# EAGLE design atmega328_isp (EAGLE 6.5.0)
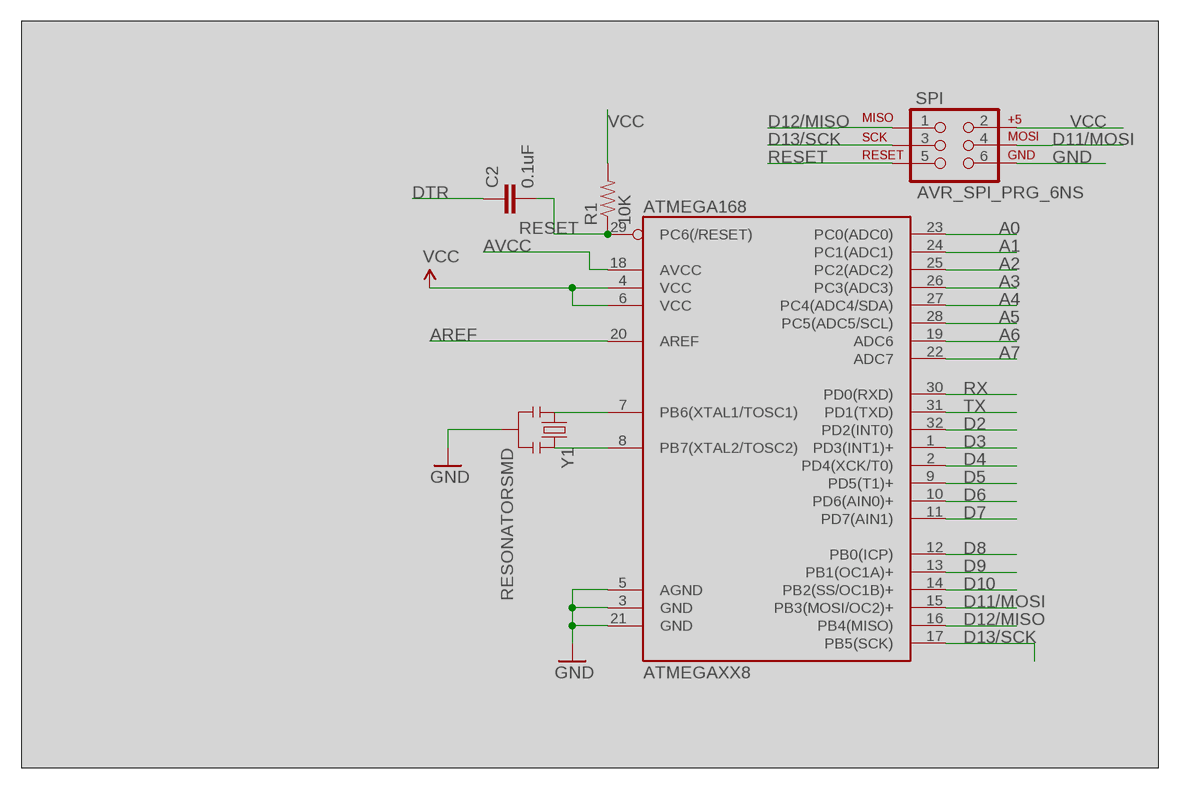
[diagram p0: schematic, sheet 1]

## Parts
ATMEGAXX8  ATMEGA168  [TQFP32-08]
C2  0.1uF  CAP0805  [0805]
R1  10K  RESISTOR0805-RES  [0805]
SPI  AVR_SPI_PRG_6NS  [2X3-NS]
Y1  RESONATORSMD  [RESONATOR-SMD]

## Nets
A0: ATMEGAXX8.23(PC0(ADC0))
A1: ATMEGAXX8.24(PC1(ADC1))
A2: ATMEGAXX8.25(PC2(ADC2))
A3: ATMEGAXX8.26(PC3(ADC3))
A4: ATMEGAXX8.27(PC4(ADC4/SDA))
A5: ATMEGAXX8.28(PC5(ADC5/SCL))
A6: ATMEGAXX8.19(ADC6)
A7: ATMEGAXX8.22(ADC7)
AREF: ATMEGAXX8.20(AREF)
AVCC: ATMEGAXX8.18(AVCC)
D2: ATMEGAXX8.32(PD2(INT0))
D3: ATMEGAXX8.1(PD3(INT1)+)
D4: ATMEGAXX8.2(PD4(XCK/T0))
D5: ATMEGAXX8.9(PD5(T1)+)
D6: ATMEGAXX8.10(PD6(AIN0)+)
D7: ATMEGAXX8.11(PD7(AIN1))
D8: ATMEGAXX8.12(PB0(ICP))
D9: ATMEGAXX8.13(PB1(OC1A)+)
D10: ATMEGAXX8.14(PB2(SS/OC1B)+)
D11/MOSI: ATMEGAXX8.15(PB3(MOSI/OC2)+) SPI.4
D12/MISO: ATMEGAXX8.16(PB4(MISO)) SPI.1
D13/SCK: ATMEGAXX8.17(PB5(SCK)) SPI.3
DTR: C2.1
GND: ATMEGAXX8.3(GND) ATMEGAXX8.5(AGND) ATMEGAXX8.21(GND) SPI.6 Y1.2
RESET: ATMEGAXX8.29(PC6(/RESET)) C2.2 R1.1 SPI.5
RX: ATMEGAXX8.30(PD0(RXD))
TX: ATMEGAXX8.31(PD1(TXD))
VCC: ATMEGAXX8.4(VCC) ATMEGAXX8.6(VCC) R1.2 SPI.2
XTAL1: ATMEGAXX8.7(PB6(XTAL1/TOSC1)) Y1.1
XTAL2: ATMEGAXX8.8(PB7(XTAL2/TOSC2)) Y1.3

## Library data of the parts
ATMEGAXX8 = SparkFun:ATMEGA168
C2 = SparkFun:CAP: Capacitor Standard 0603 ceramic capacitor, and 0.1" leaded capacitor.
R1 = SparkFun:RESISTOR: Resistor Basic schematic elements and footprints for 0603, 1206, and PTH resistors.
SPI = SparkFun:AVR_SPI_PRG_6: AVR ISP 6 Pin This is the reduced ISP connector for AVR programming. Common on Arduino. This footprint will take up less PCB space and can be used with a 10-pin to 6-pin adapter such as SKU: BOB-08508
Y1 = SparkFun:RESONATOR: Resonator Small SMD resonator. This is the itty bitty 10/20MHz resonators with built in caps. CSTCE10M0G55 and CSTCE20M0V53. Footprint has been reviewed closely but hasn't been tested yet.

## Board
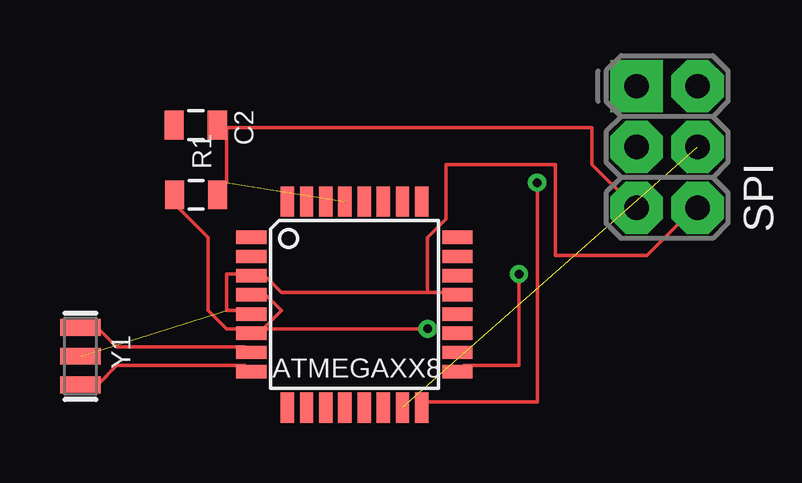
[diagram p1: board, top side]
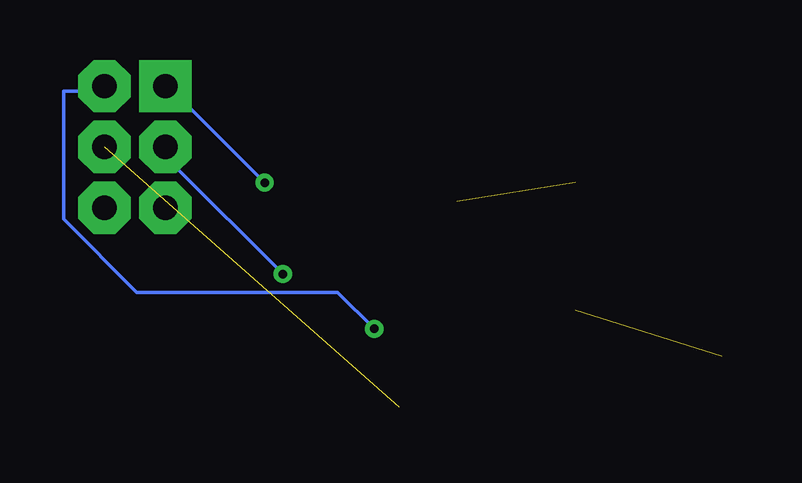
[diagram p2: board, bottom side, seen from below]

No outline drawn. Coordinates in mm, seen from the top.
Copper layers (1*16): Top 0.0178mm / dielectric 59mil / Bottom 0.0178mm
Design rules "default": minimum track width 6mil, minimum drill 14mil, track to track 6mil, track to pad 6mil, pad to pad 6mil, via to via 6mil, smd to smd 6mil, copper to edge 20mil, drill to drill 16mil, minimum pad ring 8mil, minimum via ring 8mil, stop-mask expansion 3mil, vias tented up to drill 0mil, thermal gap 10mil

### Footprints (pad centres in the part's own frame; a part is rotated, then mirrored left to right if it is on the bottom)
TQFP32-08 = smd 1.27 x 0.559: 1 -4.293,2.8; 2 -4.293,2; 3 -4.293,1.2; 4 -4.293,0.4; 5 -4.293,-0.4; 6 -4.293,-1.2; 7 -4.293,-2; 8 -4.293,-2.8; 17 4.293,-2.8; 18 4.293,-2; 19 4.293,-1.2; 20 4.293,-0.4; 21 4.293,0.4; 22 4.293,1.2; 23 4.293,2; 24 4.293,2.8 | smd 0.559 x 1.27: 9 -2.8,-4.293; 10 -2,-4.293; 11 -1.2,-4.293; 12 -0.4,-4.293; 13 0.4,-4.293; 14 1.2,-4.293; 15 2,-4.293; 16 2.8,-4.293; 25 2.8,4.293; 26 2,4.293; 27 1.2,4.293; 28 0.4,4.293; 29 -0.4,4.293; 30 -1.2,4.293; 31 -2,4.293; 32 -2.8,4.293
0805 = smd 0.8 x 1.2: 1 -0.9,0; 2 0.9,0
2X3-NS = drill 1.016 pad 2.184 square: 1 -2.54,-1.27 | drill 1.016 pad 2.184 octagon: 2 -2.54,1.27; 3 0,-1.27; 4 0,1.27; 5 2.54,-1.27; 6 2.54,1.27
RESONATOR-SMD = smd 0.7 x 1.7: 1 -1.2,0; 2 0,0; 3 1.2,0

### Placement (x,y rotation side)
ATMEGAXX8  32.77,27.69 0 top
C2  26.15,35.16 0 top
R1  26.16,32.26 180 top
SPI  45.8,34.25 270 top
Y1  21.34,25.53 270 top

### Tracks (layer width: path | path; a pad name or v marks a point on that pad's centre or on a via)
D11/MOSI  (1 unrouted)
D12/MISO  (via drill 0.36)
  Top 0.152: v40.39,32.77 40.39,23.62 35.81,23.62 ATMEGAXX8.16
  Bottom 0.152: v40.39,32.77 44.2,36.58 SPI.1
D13/SCK  (via drill 0.36)
  Top 0.152: v39.62,28.96 39.62,25.15 37.34,25.15 ATMEGAXX8.17
  Bottom 0.152: v39.62,28.96 44.2,33.53 SPI.3
GND  (1 unrouted)
  Top 0.152: ATMEGAXX8.5 28.19,27.43 27.43,27.43 27.43,28.96 28.19,28.96 ATMEGAXX8.3 28.96,28.96 29.72,28.19 35.81,28.19 | 35.81,28.19 36.58,28.19 ATMEGAXX8.21 | 35.81,28.19 35.81,30.48 36.58,31.24 36.58,33.53 41.15,33.53 41.15,29.72 44.96,29.72 46.48,31.24 SPI.6
RESET  (1 unrouted)
  Top 0.152: 27.43,35.05 27.43,32.77 R1.1 | 27.43,35.05 42.67,35.05 42.67,33.53 44.2,32 SPI.5 | 27.43,35.05 C2.2
VCC  (via drill 0.36)
  Top 0.152: R1.2 25.15,32 26.67,30.48 26.67,27.43 27.43,26.67 28.19,26.67 ATMEGAXX8.6 28.96,26.67 | 28.96,26.67 29.72,27.43 28.96,28.19 ATMEGAXX8.4 | v35.81,26.67 28.96,26.67
  Bottom 0.152: v35.81,26.67 37.34,28.19 45.72,28.19 48.77,31.24 48.77,36.58 47.24,36.58 SPI.2
XTAL1
  Top 0.152: ATMEGAXX8.7 28.19,25.91 22.86,25.91 22.1,26.67 21.34,26.67 Y1.1
XTAL2
  Top 0.152: ATMEGAXX8.8 28.19,25.15 22.86,25.15 22.1,24.38 21.34,24.38 Y1.3